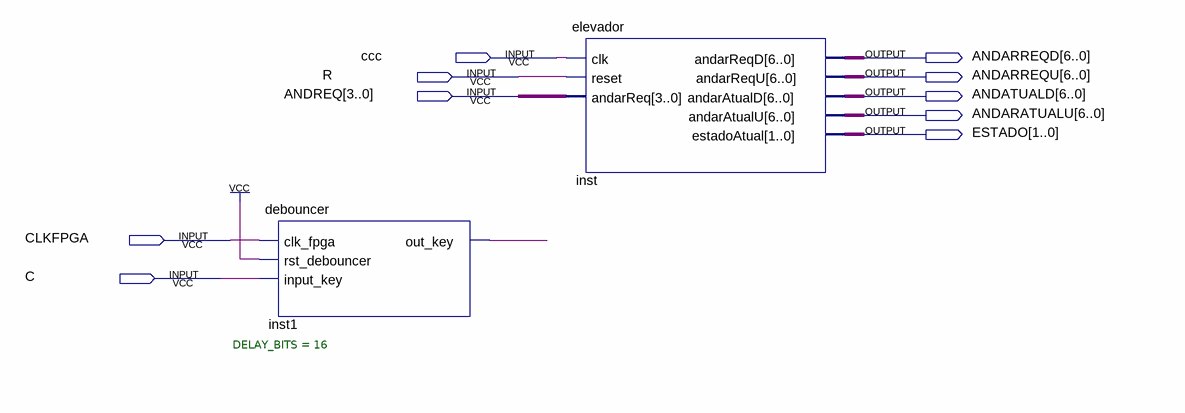
[diagram p0: schematic sheet]
// Quartus schematic elevadorEsquematico.bdf as structural Verilog: 2 symbols, 10 pins
module elevadorEsquematico (
  input  ccc,
  input  R,
  input  [3:0] ANDREQ,
  input  CLKFPGA,
  input  C,
  output [6:0] ANDARREQD,
  output [6:0] ANDARREQU,
  output [6:0] ANDATUALD,
  output [6:0] ANDARATUALU,
  output [1:0] ESTADO
);

  wire inst1_out_key;

  debouncer #(.DELAY_BITS(16)) inst1 (.clk_fpga(CLKFPGA), .rst_debouncer(1'b1), .input_key(C), .out_key(inst1_out_key));
  elevador inst (
    .clk(ccc), .reset(R), .andarReq(ANDREQ), .andarReqD(ANDARREQD), .andarReqU(ANDARREQU),
    .andarAtualD(ANDATUALD), .andarAtualU(ANDARATUALU), .estadoAtual(ESTADO));
endmodule
